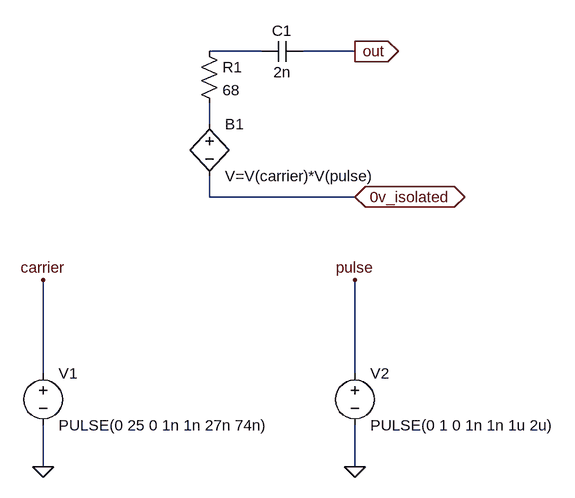
[diagram p0: schematic dummy_edsac.asc]
dummy_edsac.asc, the LTspice schematic file:
Version 4
SHEET 1 888 680
WIRE 432 -448 352 -448
WIRE 576 -448 496 -448
WIRE 352 -336 352 -368
WIRE 352 -224 352 -256
WIRE 576 -224 352 -224
WIRE 96 48 96 -96
WIRE 576 48 576 -96
WIRE 96 192 96 128
WIRE 576 192 576 128
FLAG 96 192 0
FLAG 576 192 0
FLAG 96 -96 carrier
FLAG 576 -96 pulse
FLAG 576 -448 out
IOPIN 576 -448 Out
FLAG 576 -224 0v_isolated
IOPIN 576 -224 BiDir
SYMBOL voltage 96 32 R0
WINDOW 123 0 0 Left 2
WINDOW 39 0 0 Left 2
SYMATTR InstName V1
SYMATTR Value PULSE(0 25 0 1n 1n 27n 74n)
SYMBOL voltage 576 32 R0
WINDOW 123 0 0 Left 2
WINDOW 39 0 0 Left 2
SYMATTR InstName V2
SYMATTR Value PULSE(0 1 0 1n 1n 1u 2u)
SYMBOL bv 352 -352 R0
SYMATTR InstName B1
SYMATTR Value V=V(carrier)*V(pulse)
SYMBOL cap 496 -464 R90
WINDOW 0 0 32 VBottom 2
WINDOW 3 32 32 VTop 2
SYMATTR InstName C1
SYMATTR Value 2n
SYMBOL res 336 -464 R0
SYMATTR InstName R1
SYMATTR Value 68

The netlist it stands for:
* dummy_edsac.asc
V1 carrier 0 PULSE(0 25 0 1n 1n 27n 74n)
V2 pulse 0 PULSE(0 1 0 1n 1n 1u 2u)
B1 N002 0v_isolated V=V(carrier)*V(pulse)
C1 out N001 2n
R1 N001 N002 68
.backanno
.end